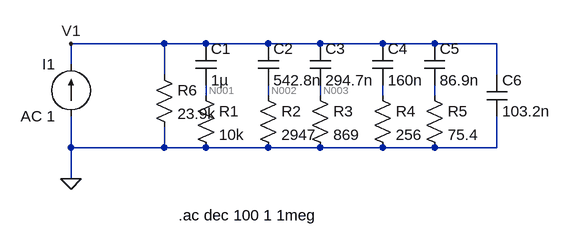
[diagram p0: schematic Paper CPE.asc]
Paper CPE.asc, the LTspice schematic file:
Version 4
SHEET 1 880 680
WIRE 112 80 -32 80
WIRE 176 80 112 80
WIRE 272 80 176 80
WIRE 352 80 272 80
WIRE 448 80 352 80
WIRE 528 80 448 80
WIRE 624 80 528 80
WIRE -32 112 -32 80
WIRE 112 128 112 80
WIRE 624 128 624 80
WIRE 176 160 176 144
WIRE 272 160 272 144
WIRE 352 160 352 144
WIRE 448 160 448 144
WIRE 528 160 528 144
WIRE -32 240 -32 192
WIRE 112 240 112 208
WIRE 112 240 -32 240
WIRE 176 240 112 240
WIRE 272 240 176 240
WIRE 352 240 272 240
WIRE 448 240 352 240
WIRE 528 240 448 240
WIRE 624 240 624 192
WIRE 624 240 528 240
WIRE -32 288 -32 240
FLAG -32 288 0
FLAG -32 80 V1
SYMBOL res 160 144 R0
SYMATTR InstName R1
SYMATTR Value 10k
SYMBOL cap 160 80 R0
SYMATTR InstName C1
SYMATTR Value 1µ
SYMBOL res 256 144 R0
SYMATTR InstName R2
SYMATTR Value 2947
SYMBOL cap 256 80 R0
SYMATTR InstName C2
SYMATTR Value 542.8n
SYMBOL res 336 144 R0
SYMATTR InstName R3
SYMATTR Value 869
SYMBOL cap 336 80 R0
SYMATTR InstName C3
SYMATTR Value 294.7n
SYMBOL res 432 144 R0
SYMATTR InstName R4
SYMATTR Value 256
SYMBOL cap 432 80 R0
SYMATTR InstName C4
SYMATTR Value 160n
SYMBOL res 512 144 R0
SYMATTR InstName R5
SYMATTR Value 75.4
SYMBOL cap 512 80 R0
SYMATTR InstName C5
SYMATTR Value 86.9n
SYMBOL cap 608 128 R0
SYMATTR InstName C6
SYMATTR Value 103.2n
SYMBOL res 96 112 R0
SYMATTR InstName R6
SYMATTR Value 23.9k
SYMBOL current -32 192 R180
WINDOW 0 24 80 Left 2
WINDOW 3 24 0 Left 2
WINDOW 123 0 0 Left 0
WINDOW 39 0 0 Left 0
SYMATTR InstName I1
SYMATTR Value AC 1
TEXT 134 344 Left 2 !.ac dec 100 1 1meg

The netlist it stands for:
* Paper CPE.asc
R1 N001 0 10k
C1 V1 N001 1µ
R2 N002 0 2947
C2 V1 N002 542.8n
R3 N003 0 869
C3 V1 N003 294.7n
R4 N004 0 256
C4 V1 N004 160n
R5 N005 0 75.4
C5 V1 N005 86.9n
C6 V1 0 103.2n
R6 V1 0 23.9k
I1 0 V1 AC 1
.ac dec 100 1 1meg
.backanno
.end

* Results of the author's LTspice run, read from the files saved beside the schematic
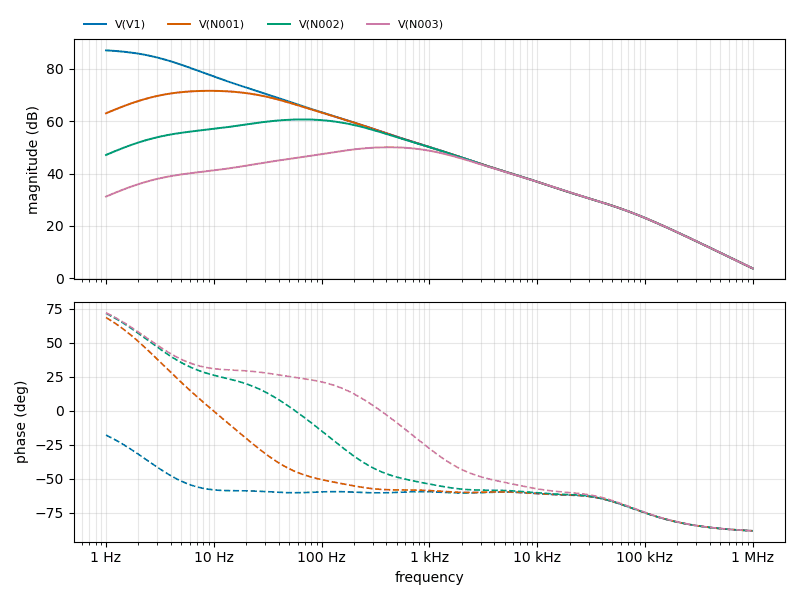
[diagram p1: AC Analysis of Paper CPE.asc, plotted from the saved traces]
* AC Analysis, 1 run:
*   V(V1): 87.04 dB at 1 Hz, 3.75 dB at 1 MHz, peak 87.04 dB at 1 Hz, 3 dB below the peak at 3.169 Hz
*   V(N001): 62.99 dB at 1 Hz, 3.75 dB at 1 MHz, peak 71.59 dB at 9.12 Hz, 3 dB below the peak at 2.359 Hz and 36.85 Hz
*   V(N002): 47.09 dB at 1 Hz, 3.75 dB at 1 MHz, peak 60.66 dB at 66.07 Hz, 3 dB below the peak at 13 Hz and 244.5 Hz
*   V(N003): 31.18 dB at 1 Hz, 3.75 dB at 1 MHz, peak 50.03 dB at 416.9 Hz, 3 dB below the peak at 87.36 Hz and 1.533 kHz